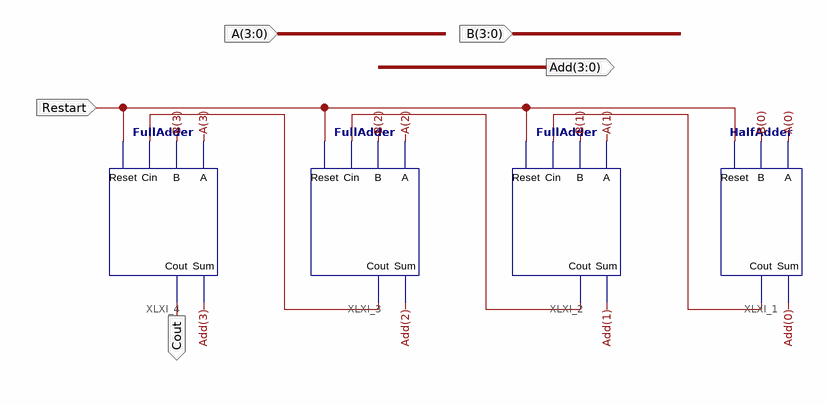
[diagram p0: schematic sheet 1]
// Xilinx ISE schematic FourBitAdder.sch (artix7) as structural Verilog: 4 symbols, 5 ports
module FourBitAdder (
  input  Restart,
  input  [3:0] A,
  input  [3:0] B,
  output Cout,
  output [3:0] Add
);

  wire XLXN_5, XLXN_6, XLXN_8;

  HalfAdder XLXI_1 (.A(A[0]), .B(B[0]), .Cout(XLXN_5), .Reset(Restart), .Sum(Add[0]));
  FullAdder XLXI_2 (.A(A[1]), .B(B[1]), .Cin(XLXN_5), .Cout(XLXN_6), .Reset(Restart), .Sum(Add[1]));
  FullAdder XLXI_3 (.A(A[2]), .B(B[2]), .Cin(XLXN_6), .Cout(XLXN_8), .Reset(Restart), .Sum(Add[2]));
  FullAdder XLXI_4 (.A(A[3]), .B(B[3]), .Cin(XLXN_8), .Cout(Cout), .Reset(Restart), .Sum(Add[3]));
endmodule
